# EAGLE design 4 inputs (EAGLE 9.3.1)
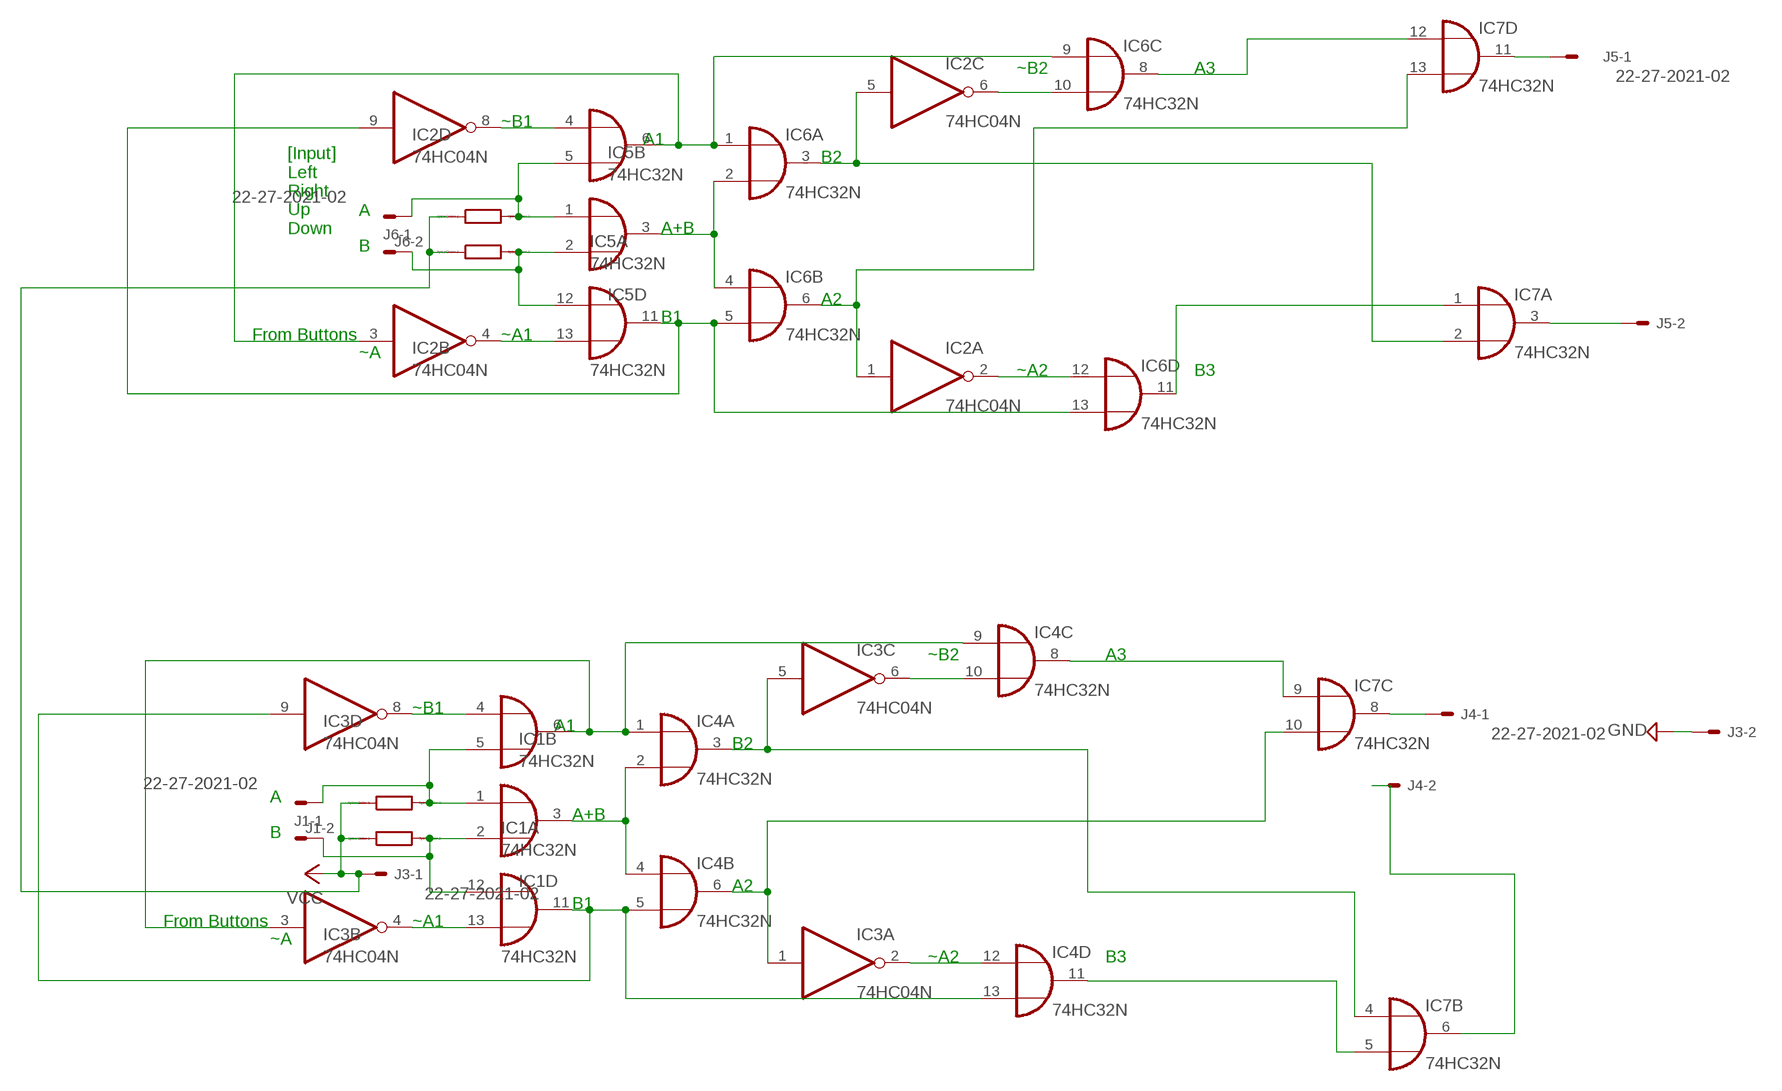
[diagram p0: schematic, sheet 1]

## Parts
IC1  74HC32N  [DIL14]
IC2  74HC04N  [DIL14]
IC3  74HC04N  [DIL14]
IC4  74HC32N  [DIL14]
IC5  74HC32N  [DIL14]
IC6  74HC32N  [DIL14]
IC7  74HC32N  [DIL14]
J1  22-27-2021-02  [6410-02]
J3  22-27-2021-02  [6410-02]
J4  22-27-2021-02  [6410-02]
J5  22-27-2021-02  [6410-02]
J6  22-27-2021-02  [6410-02]
R1  R0204/7  [0204/7]
R2  R0204/7  [0204/7]
R3  R0204/7  [0204/7]
R4  R0204/7  [0204/7]

## Nets
A0: IC1.1(A:I0) IC1.5(B:I1) J1.1 R3.2
A1: IC1.6(B:O) IC3.3(B:I) IC4.1(A:I0) IC4.9(C:I0)
A2: IC5.1(A:I0) IC5.5(B:I1) J6.1 R1.2
A2ORA3: IC3.1(A:I) IC4.6(B:O) IC7.10(C:I1)
A2OUT: IC7.11(D:O) J5.1
A3: IC2.3(B:I) IC5.6(B:O) IC6.1(A:I0) IC6.9(C:I0)
A+B: IC1.3(A:O) IC4.2(A:I1) IC4.4(B:I0)
A+B1: IC5.3(A:O) IC6.2(A:I1) IC6.4(B:I0)
AOUT: IC7.8(C:O) J4.1
B0: IC1.2(A:I1) IC1.12(D:I0) J1.2 R4.2
B1: IC1.11(D:O) IC3.9(D:I) IC4.5(B:I1) IC4.13(D:I1)
B2: IC5.2(A:I1) IC5.12(D:I0) J6.2 R2.2
B2ORB1: IC6.11(D:O) IC7.1(A:I0)
B2ORB3: IC3.5(C:I) IC4.3(A:O) IC7.4(B:I0)
B2OUT: IC7.3(A:O) J5.2
B3: IC2.9(D:I) IC5.11(D:O) IC6.5(B:I1) IC6.13(D:I1)
BOUT: IC7.6(B:O) J4.2
GND: J3.2
N$1: IC6.8(C:O) IC7.12(D:I0)
N$3: IC2.5(C:I) IC6.3(A:O) IC7.2(A:I1)
N$4: IC2.1(A:I) IC6.6(B:O) IC7.13(D:I1)
N$6: IC4.8(C:O) IC7.9(C:I0)
N$7: IC4.11(D:O) IC7.5(B:I1)
VCC: J3.1 R1.1 R2.1 R3.1 R4.1
~A1: IC1.13(D:I1) IC3.4(B:O)
~A2: IC3.2(A:O) IC4.12(D:I0)
~A3: IC2.2(A:O) IC6.12(D:I0)
~A4: IC2.4(B:O) IC5.13(D:I1)
~B1: IC1.4(B:I0) IC3.8(D:O)
~B2: IC3.6(C:O) IC4.10(C:I1)
~B3: IC2.8(D:O) IC5.4(B:I0)
~B4: IC2.6(C:O) IC6.10(C:I1)
Unconnected: IC1.8(C:O) IC1.9(C:I0) IC1.10(C:I1) IC2.10(E:O) IC2.11(E:I) IC2.12(F:O) IC2.13(F:I) IC3.10(E:O) IC3.11(E:I) IC3.12(F:O) IC3.13(F:I) IC5.8(C:O) IC5.9(C:I0) IC5.10(C:I1)

## Notes on the sheet
- ~B2 | A3
- ~B1
- A1
- B2
- A
- [Input]
  Left
  Right
  Up
  Down
- A+B
- B
- A2
- B1
- From Buttons | ~A1
- ~A
- ~A2 | B3
- ~B2 | A3
- ~B1
- A1
- B2
- A
- A+B
- B
- A2
- B1
- From Buttons | ~A1
- ~A
- ~A2 | B3

## Power pins joined to a net without a drawn wire
GND: IC1.7(P:GND) IC2.7(P:GND) IC3.7(P:GND) IC4.7(P:GND) IC5.7(P:GND) IC6.7(P:GND) IC7.7(P:GND)
VCC: IC1.14(P:VCC) IC2.14(P:VCC) IC3.14(P:VCC) IC4.14(P:VCC) IC5.14(P:VCC) IC6.14(P:VCC) IC7.14(P:VCC)

## Library data of the parts
IC1 IC4-IC7 = 74xx-eu:74*32: Quad 2-input OR gate
IC2 IC3 = 74xx-eu:74*04: Hex INVERTER
J1 J3-J6 = con-molex:22-?-02: CONNECTOR wire to board 2.54 mm (.1 inch) pitch header; MF: MOLEX; OC_FARNELL: unknown; OC_NEWARK: unknown
R1-R4 = eagle-ltspice:R: RESISTOR, European symbol; SPICEMODEL: NONE; SPICEPREFIX: R

## Net classes
0 default: width 0.406 mm, clearance 0.205 mm

## Board
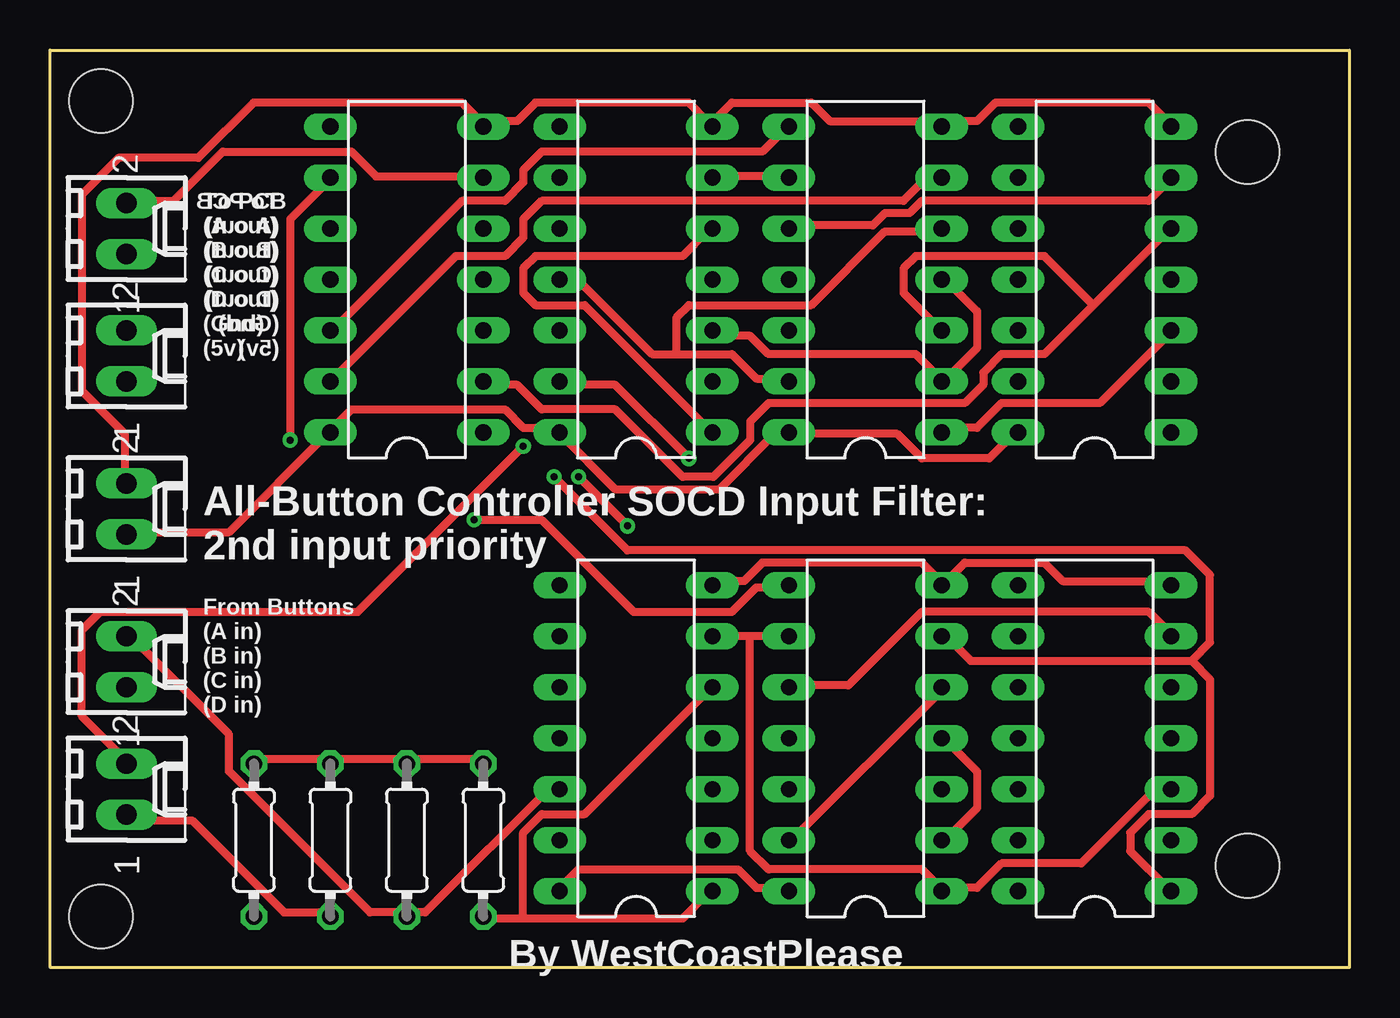
[diagram p1: board, top side]
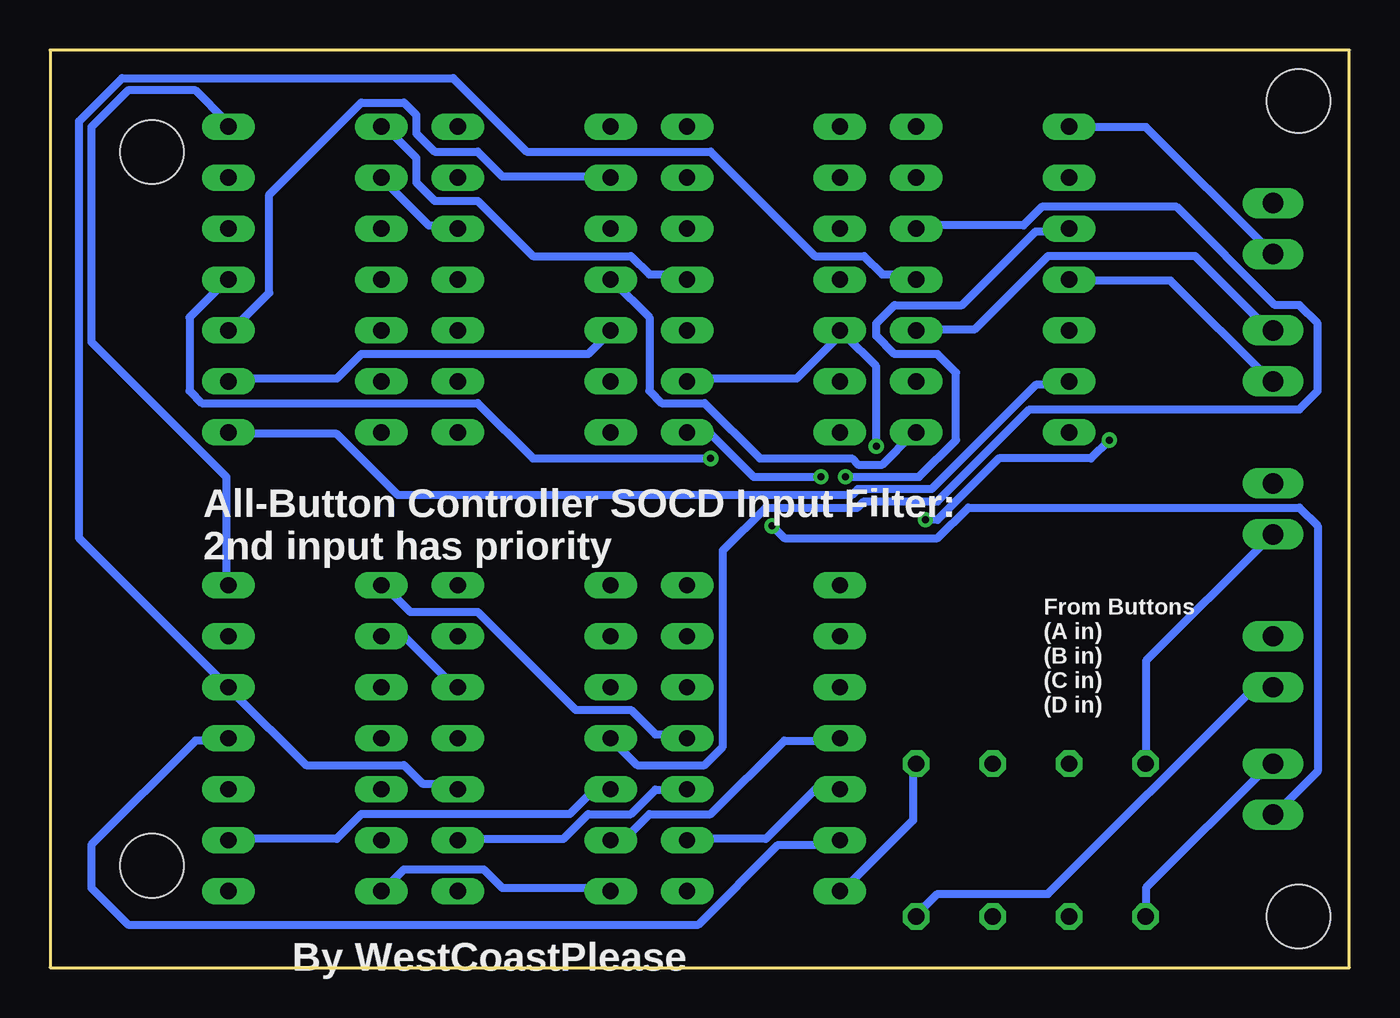
[diagram p2: board, bottom side, seen from below]

Size 64.77 x 45.72 mm. Coordinates in mm from the lower left corner, seen from the top.
Outline: 0,45.72 64.77,45.72 64.77,0 0,0 0,45.72
Copper layers (1*16): Top 0.035mm / dielectric 1.5mm / Bottom 0.035mm
Design rules "default": minimum track width 6mil, minimum drill 0.35mm, track to track 6mil, track to pad 6mil, pad to pad 6mil, via to via 6mil, smd to smd 6mil, copper to edge 40mil, drill to drill 6mil, minimum pad ring 10mil, minimum via ring 8mil, stop-mask expansion 4mil, vias tented up to drill 0mil, thermal gap 10mil
Holes 3.17 mm at 2.54,2.54 59.69,5.08 2.54,43.18 59.69,40.64

### Footprints (pad centres in the part's own frame; a part is rotated, then mirrored left to right if it is on the bottom)
DIL14 = drill 0.813 long: 1 -7.62,-3.81; 2 -5.08,-3.81; 3 -2.54,-3.81; 4 0,-3.81; 5 2.54,-3.81; 6 5.08,-3.81; 7 7.62,-3.81; 8 7.62,3.81; 9 5.08,3.81; 10 2.54,3.81; 11 0,3.81; 12 -2.54,3.81; 13 -5.08,3.81; 14 -7.62,3.81
6410-02 = drill 1.016 long: 1 1.27,0; 2 -1.27,0
0204/7 = drill 0.813 octagon: 1 -3.81,0; 2 3.81,0

### Placement (x,y rotation side)
IC1  29.21,11.43 90 top
IC2  52.07,34.29 90 top
IC3  52.07,11.43 90 top
IC4  40.64,11.43 90 top
IC5  29.21,34.29 90 top
IC6  40.64,34.29 90 top
IC7  17.78,34.29 90 top
J1  3.81,15.24 270 top
J3  3.81,22.86 270 top
J4  3.81,36.83 270 top
J5  3.81,30.48 270 top
J6  3.81,8.89 270 top
R1  13.97,6.35 270 top
R2  10.16,6.35 270 top
R3  21.59,6.35 270 top
R4  17.78,6.35 270 top

### Tracks (layer width: path | path; a pad name or v marks a point on that pad's centre or on a via)
A0
  Top 0.406: 23.59,2.45 31.53,2.45 32.76,3.67 IC1.1 | 23.59,2.45 21.75,2.45 R3.2 | 23.59,2.45 23.59,6.72 24.5,7.64 26.64,7.64 32.76,13.76 IC1.5
  Bottom 0.406: J1.1 4.02,13.76 4.94,13.76 15.03,3.67 20.53,3.67 21.45,2.75 R3.2
A1
  Top 0.406: 34.9,16.51 36.73,16.51 IC4.9 | 34.9,16.51 33.06,16.51 IC1.6 | IC3.3 55.69,8.87 55.07,8.87 51.41,5.2 47.43,5.2 46.21,3.97 44.68,3.97 IC4.1 44.37,3.97 43.46,4.89 35.81,4.89 34.9,5.81 34.9,16.51
A2  (via drill 0.35)
  Top 0.406: R1.2 13.8,2.75 11.66,2.75 7.08,7.34 4.02,7.34 J6.1 | IC5.1 32.76,26.9 26.64,33.02 24.2,33.02 23.59,33.63 23.59,34.85 24.2,35.46 31.53,35.46 32.76,36.68 IC5.5 | v26.34,24.46 v28.78,22.01
  Bottom 0.406: v28.78,22.01 28.17,21.4 20.53,21.4 19,22.93 2.49,22.93 1.58,22.01 1.58,9.78 3.72,7.64 J6.1 | v26.34,24.46 29.7,24.46 31.84,26.6 32.76,26.6 IC5.1
A2ORA3  (via drill 0.35)
  Top 0.406: v25.11,24.46 28.78,20.79 56.6,20.79 57.82,19.57 57.82,16.2 56.91,15.29 | 56.91,15.29 45.9,15.29 44.68,16.51 IC4.6 | 56.91,15.29 57.82,14.37 57.82,8.56 56.91,7.64 54.77,7.64 53.85,6.72 53.85,5.81 55.69,3.97 IC3.1
  Bottom 0.406: v25.11,24.46 21.45,24.46 19.61,26.29 19.61,29.65 20.53,30.57 22.67,30.57 23.59,31.49 23.59,32.1 22.67,33.02 19.31,33.02 15.64,36.68 14.11,36.68 IC7.10
A2OUT
  Bottom 0.406: IC7.11 13.8,34.24 8.91,34.24 4.02,29.35 J5.1
A3
  Top 0.406: IC5.6 33.06,39.44 36.73,39.44 IC6.9 | IC6.1 44.68,26.9 46.21,26.9 47.43,28.12 52.32,28.12 55.69,31.49 IC2.3
  Bottom 0.406: IC6.9 37.04,39.44 42.23,39.44 43.46,40.66 45.6,40.66 46.51,41.58 46.51,42.49 47.12,43.1 49.27,43.1 53.85,38.52 53.85,33.63 55.69,31.79 IC2.3
A+B
  Top 0.406: IC4.2 44.68,6.42 46.21,7.95 46.21,9.78 44.68,11.31 IC4.4
  Bottom 0.406: IC1.3 33.06,8.87 34.59,8.87 35.81,7.64 37.95,7.64 39.18,6.42 44.37,6.42 IC4.2
A+B1
  Top 0.406: IC6.4 44.68,34.24 46.21,32.71 46.21,30.88 44.68,29.35 IC6.2 44.37,29.35 43.15,30.57 35.81,30.57 34.9,31.49 33.06,31.49 IC5.3
AOUT
  Bottom 0.406: IC7.8 13.8,41.88 10.13,41.88 4.02,35.77 J4.1
B0
  Top 0.406: IC1.12 25.11,9.17 18.7,2.75 18.08,2.75 R4.2 17.78,2.75 15.94,2.75 8.91,9.78 8.91,11.62 4.02,16.51 J1.2
  Bottom 0.406: IC1.2 32.76,6.42 29.09,6.42 26.64,8.87 25.42,8.87 IC1.12
B1
  Top 0.406: IC4.13 37.04,6.42 44.37,13.76 IC4.5
  Bottom 0.406: IC1.11 25.42,11.31 28.17,11.31 31.84,7.64 34.9,7.64 36.12,6.42 36.73,6.42 IC4.13 | IC3.9 48.04,16.51 47.12,16.51 44.68,14.06 IC4.5
B2  (via drill 0.35)
  Top 0.406: v23.59,25.98 15.33,17.73 2.49,17.73 1.58,16.81 1.58,12.53 3.72,10.39 J6.2
  Bottom 0.406: IC5.2 32.76,29.35 27.56,29.35 25.42,31.49 IC5.12 25.11,31.49 23.59,29.96 v23.59,25.98 | R2.2 10.13,2.75 10.13,3.97 4.02,10.09 J6.2
B2ORB1
  Bottom 0.406: IC7.1 21.75,26.6 23.28,25.07 24.5,25.07 24.81,25.37 29.39,25.37 32.15,28.12 34.29,28.12 34.9,28.74 34.9,32.4 36.73,34.24 IC6.11
B2ORB3
  Bottom 0.406: IC7.4 21.75,34.54 23.28,34.54 24.2,35.46 26.64,35.46 31.84,40.66 41.01,40.66 44.68,44.33 61.19,44.33 63.33,42.19 63.33,21.4 55.99,14.06 IC3.5 55.69,13.76 52.02,10.09 47.12,10.09 46.21,9.17 44.68,9.17 IC4.3
B2OUT
  Bottom 0.406: IC7.3 21.45,31.79 18.7,31.79 15.03,35.46 7.69,35.46 4.02,31.79 J5.2
B3
  Top 0.406: 31.23,30.57 30.01,30.57 26.34,34.24 25.42,34.24 IC5.11 | 31.23,30.57 33.98,30.57 35.2,29.35 36.73,29.35 IC6.13 | 31.23,30.57 31.23,32.4 31.84,33.02 37.95,33.02 41.62,36.68 44.37,36.68 IC6.5
  Bottom 0.406: IC6.5 44.68,36.99 45.9,36.99 48.04,39.13 IC2.9
BOUT
  Top 0.406: IC7.6 21.45,39.44 16.25,39.44 15.03,40.66 8.61,40.66 6.16,38.21 4.02,38.21 J4.2
GND
  Top 0.406: IC1.7 33.06,19.26 34.59,19.26 35.51,20.18 43.46,20.18 44.37,19.26 IC4.7 44.68,19.26 45.6,20.18 49.57,20.18 50.49,19.26 55.69,19.26 IC3.7 | IC2.7 55.69,42.19 54.77,43.1 47.12,43.1 46.21,42.19 44.68,42.19 IC6.7 44.37,42.19 38.87,42.19 37.95,43.1 33.98,43.1 33.06,42.19 IC5.7 32.76,42.19 31.84,43.1 24.2,43.1 23.28,42.19 21.75,42.19 IC7.7 21.45,42.19 20.53,43.1 10.13,43.1 7.38,40.35 3.41,40.35 1.58,38.52 1.58,28.74 3.72,26.6 3.72,24.15 J3.2
  Bottom 0.406: IC3.7 55.99,19.26 55.99,24.46 62.72,31.18 62.72,41.88 60.88,43.72 57.52,43.72 55.99,42.19 IC2.7
N$1
  Top 0.406: IC7.12 14.11,31.79 20.53,38.21 22.67,38.21 23.59,39.13 23.59,39.74 24.5,40.66 35.51,40.66 36.73,41.88 IC6.8
N$3
  Top 0.406: 52.02,33.02 55.69,36.68 IC2.5 | 52.02,33.02 49.57,30.57 47.43,30.57 46.51,29.65 46.51,29.04 45.6,28.12 35.81,28.12 34.9,27.21 34.9,26.29 33.06,24.46 31.53,24.46 28.17,27.82 24.5,27.82 23.28,29.04 21.75,29.04 IC7.2 | 52.02,33.02 49.57,35.46 43.15,35.46 42.54,34.85 42.54,33.63 44.37,31.79 IC6.3
N$4
  Top 0.406: IC7.13 14.11,29.35 20.22,35.46 22.67,35.46 23.59,36.38 23.59,37.3 24.5,38.21 42.54,38.21 43.46,39.13 44.37,39.13 IC6.6
  Bottom 0.406: IC2.1 55.69,26.6 50.49,26.6 47.43,23.54 24.81,23.54 24.5,23.84 20.84,23.84 15.64,29.04 14.11,29.04 IC7.13
N$6  (via drill 0.35)
  Top 0.406: v21.14,22.32 24.5,22.32 29.09,17.73 33.98,17.73 35.2,18.95 36.73,18.95 IC4.8 | v11.97,26.29 11.97,37.3 13.8,39.13 IC7.9
  Bottom 0.406: v21.14,22.32 20.53,22.32 17.47,25.37 12.89,25.37 v11.97,26.29
N$7
  Bottom 0.406: IC7.5 21.45,36.99 16.25,36.99 15.33,37.91 8.61,37.91 3.72,33.02 2.49,33.02 1.58,32.1 1.58,28.74 2.49,27.82 15.94,27.82 20.53,23.23 24.2,23.23 24.5,22.93 29.09,22.93 31.23,20.79 31.23,11.01 32.15,10.09 35.51,10.09 36.73,11.31 IC4.11
VCC
  Top 0.406: R2.1 10.44,10.39 13.8,10.39 R1.1 14.11,10.39 17.78,10.39 R4.1 18.08,10.39 21.45,10.39 R3.1 | IC4.14 36.73,3.97 35.2,3.97 34.29,4.89 26.34,4.89 25.42,3.97 IC1.14 | IC2.14 48.04,26.6 46.82,25.37 43.46,25.37 42.23,26.6 37.04,26.6 IC6.14 36.73,26.6 36.12,26.6 33.37,23.84 28.17,23.84 25.42,26.6 IC5.14 25.11,26.9 23.59,26.9 22.67,27.82 15.03,27.82 14.11,26.9 IC7.14 13.8,26.6 8.91,21.7 4.02,21.7 J3.1
  Bottom 0.406: IC4.14 37.04,3.97 42.23,3.97 43.15,4.89 47.12,4.89 48.04,3.97 IC3.14 | IC1.14 25.11,3.97 21.75,7.34 21.75,10.09 R3.1 | R2.1 10.13,10.39 10.13,15.29 4.02,21.4 J3.1
~A1
  Bottom 0.406: IC1.13 25.42,6.11 28.48,6.11 32.45,2.14 60.88,2.14 62.72,3.97 62.72,6.11 57.52,11.31 55.99,11.31 IC3.4
~A2
  Bottom 0.406: IC3.2 55.69,6.42 50.49,6.42 49.27,7.64 38.87,7.64 37.65,8.87 37.04,8.87 IC4.12
~A3
  Bottom 0.406: IC2.2 55.69,29.35 50.49,29.35 49.27,30.57 37.95,30.57 37.04,31.49 IC6.12
~A4  (via drill 0.35)
  Top 0.406: v31.84,25.37 28.17,29.04 25.42,29.04 IC5.13
  Bottom 0.406: v31.84,25.37 40.71,25.37 43.46,28.12 57.21,28.12 57.82,28.74 57.82,32.4 55.99,34.24 IC2.4
~B1
  Bottom 0.406: IC1.4 33.06,11.62 34.59,11.62 35.81,12.84 38.57,12.84 43.46,17.73 46.82,17.73 48.04,18.95 IC3.8
~B2
  Top 0.406: IC4.10 37.04,14.06 39.79,14.06 43.46,17.73 54.77,17.73 55.69,16.81 IC3.6
~B3
  Bottom 0.406: IC5.4 33.06,34.54 34.9,34.54 35.81,35.46 40.71,35.46 43.46,38.21 45.6,38.21 46.51,39.13 46.51,40.35 48.04,41.88 IC2.8
~B4
  Top 0.406: IC6.10 37.04,36.99 41.01,36.99 41.62,37.6 42.85,37.6 43.46,38.21 54.77,38.21 55.69,39.13 IC2.6

### Text on the board
tNames: To PCB / (A out) / (B out) / (C out) / (D out) / (Gnd) / (5v) | To PCB / (A out) / (B out) / (C out) / (D out) / (Gnd) / (5v) | All-Button Controller SOCD Input Filter: / 2nd input priority | From Buttons / (A in) / (B in) / (C in) / (D in) | By WestCoastPlease
bNames: All-Button Controller SOCD Input Filter: / 2nd input has priority | From Buttons / (A in) / (B in) / (C in) / (D in) | By WestCoastPlease